# Altium schematic sheet XRSQ1010-10MH-HXRSQ1010-10MH-H.schdoc
size 127 x 101 mm
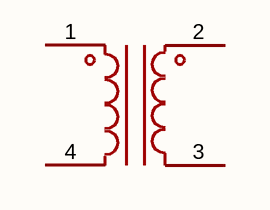
[diagram p0: XRSQ1010-10MH-HXRSQ1010-10MH-H.schdoc]

## Parts
FL?  (no value)

## Nets

Not connected (* = marked no-connect by the designer): FL? 1 2 3 4

## Library data of the parts
FL? = XRSQ1010-10MH-H: Symbol: XRSQ1010-10MH-H